# EAGLE schematic amplivias (EAGLE 6.5.0)
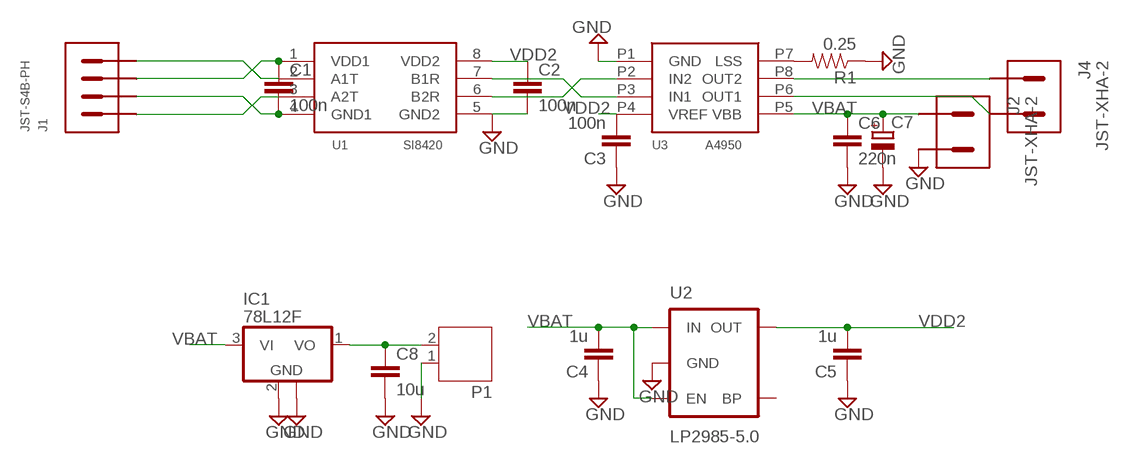
[diagram p0: schematic, sheet 1]

## Parts
C1  100n  CAP0603-CAP  [0603-CAP]
C2  100n  CAP0603-CAP  [0603-CAP]
C3  100n  CAP0603-CAP  [0603-CAP]
C4  1u  CAP0603-CAP  [0603-CAP]
C5  1u  CAP0603-CAP  [0603-CAP]
C6  220n  C-EUC0805  [C0805]
C7  CPOL-EUSANYO_SMD_E7  [SANYO-OSCON_SMD_E7]
C8  10u  C-EUC0805  [C0805]
IC1  78L12F  [SOT89]
J1  JST-S4B-PH  [JST-S4B-PH]
J2  JST-XHA-2  [JST-XHA-2]
J4  JST-XHA-2  [JST-XHA-2]
P1  JST-PH2  [JST-PH2]
R1  0.25  RESISTOR2512  [R2512]
U1  SI8420  [SO-08]
U2  LP2985-5.0  MIC52055V  [SOT23-5]
U3  A4950  [SOIC8THROUG]

## Nets
GND: C2.2 C3.1 C4.1 C5.1 C6.2 C7.- C8.2 IC1.2(GND) IC1.2@1(GND) J2.P$2(P2) P1.1 R1.1 U1.5(GND2) U2.2(GND) U3.P1(GND)
N$1: C1.2 J1.P$2 U1.4(GND1)
N$2: J1.P$1 U1.3(A2T)
N$3: C1.1 J1.P$3 U1.1(VDD1)
N$4: J1.P$4 U1.2(A1T)
N$5: R1.2 U3.P7(LSS)
N$6: U1.7(B1R) U3.P3(IN1)
N$7: U1.6(B2R) U3.P2(IN2)
N$8: C8.1 IC1.1(VO) P1.2
N$9: J4.P$1(P1) U3.P8(OUT2)
N$10: J4.P$2(P2) U3.P6(OUT1)
VBAT: C4.2 C6.1 C7.+ IC1.3(VI) J2.P$1(P1) U2.1(IN) U2.3(EN) U3.P5(VBB)
VDD2: C2.1 C3.2 C5.2 U1.8(VDD2) U2.5(OUT) U3.P4(VREF)
Unconnected: U2.4(BP)

## Library data of the parts
C1-C5 = SparkFun-Capacitors:CAP: Capacitor Standard 0603 ceramic capacitor, and 0.1" leaded capacitor.
C6 C8 = rcl:C-EU: CAPACITOR, European symbol
C7 = rcl:CPOL-EU: POLARIZED CAPACITOR, European symbol
IC1 = linear:78L*: POSITOIV-VOLTAGE REGULATORS Output up to 100 mA Source: http://focus.ti.com/lit/ds/symlink/ua78l05.pdf
J1 = jst-ph:JST-S4B-PH
J2 J4 = TEORA:JST-XHA-2
P1 = jst-ph:JST-PH2
R1 = SparkFun-Resistors:RESISTOR: Resistor Basic schematic elements and footprints for 0603, 1206, and PTH resistors.
U1 = lsel2014:SI8420
U2 = SparkFun-PowerIC:MIC5205: MIC5205 150mA vreg 3.3V - VREG-00822 5V - VREG-00823; PROD_ID: VREG-00823
U3 = lsel2014:A4950